# Altium schematic sheet Memory.SchDoc: Memory
size A3; Organization: CU Boulder; DocumentNumber: 004; Revision: 1.1; SheetNumber: 4; SheetTotal: 8
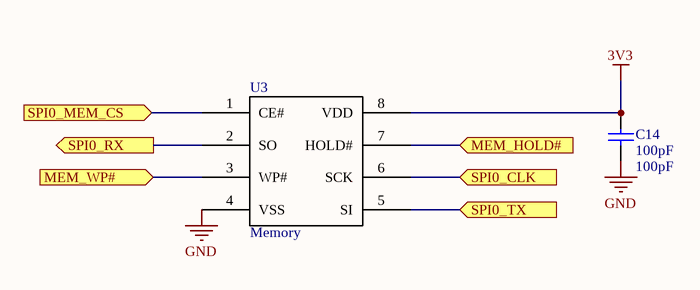
[diagram p0: Memory.SchDoc]

## Parts
C14  100pF  [1608[0603]]
U3  Memory  [SST25VF010A]

## Ports
MEM_HOLD# (in), MEM_WP# (in), SPI0_CLK (in), SPI0_MEM_CS (in), SPI0_RX (out), SPI0_TX (in)

## Nets
3V3: C14.2 U3.8(VDD)
GND: C14.1 U3.4(VSS)
MEM_HOLD#: U3.7(HOLD#) ; port MEM_HOLD#
MEM_WP#: U3.3(WP#) ; port MEM_WP#
SPI0_CLK: U3.6(SCK) ; port SPI0_CLK
SPI0_MEM_CS: U3.1(CE#) ; port SPI0_MEM_CS
SPI0_RX: U3.2(SO) ; port SPI0_RX
SPI0_TX: U3.5(SI) ; port SPI0_TX

## Notes on the sheet
- Title
- Size:
- Date:
- A3
- Number:
- Time:
- Revision:
- Sheet
- of
- File:

## Library data of the parts
C14 = Cap Semi: Capacitor (Semiconductor SIM Model); Published: 8-Jun-2000; LatestRevisionDate: 29-May-2009; LatestRevisionNote: IPC-7351 Footprint Added.; PackageReference: C1206; Publisher: Altium Limited; PackageDescription: Chip Capacitor; Value: 100pF; Supplier 1: Digi-Key; Supplier Part Number 1: 399-7824-1-ND
U3 = SST25VF010A: Supplier 1: Digi-Key; Supplier Part Number 1: SST25VF010A-33-4C-SAE-ND